# Altium project nRF24L01无线收发.PrjPCB
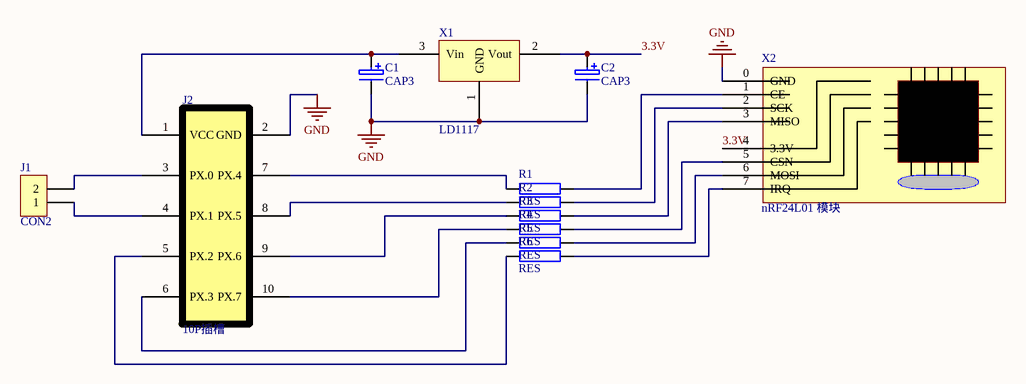
[diagram p0: nRF24L01 无线收发.SchDoc]
1 sheet, 12 parts. Net scope: global (net labels, ports and power ports of the same name join across sheets).
Board file: nRF24L01 无线收发.PcbDoc

## Sheet nRF24L01 无线收发.SchDoc
size A4

### Parts
C1  CAP3  [CAO1]
C2  CAP3  [CAO1]
J1  CON2  [sip-2]
J2  10P插槽  [10P插槽]
R1  RES  [AXIAL0.3]
R2  RES  [AXIAL0.3]
R3  RES  [AXIAL0.3]
R4  RES  [AXIAL0.3]
R5  RES  [AXIAL0.3]
R6  RES  [AXIAL0.3]
X1  LD1117  [SOT-223]
X2  nRF24L01 模块  [nRF24L01模块]

### Nets
GND: C1.2 C2.2 J2.2(GND) X1.1(GND) X2.0(GND)
3.3V: C2.1 X1.2(Vout) X2.4(3.3V)
NetC1_1: C1.1 J2.1(VCC) X1.3(Vin)
NetJ1_1: J1.1 J2.4(PX.1)
NetJ1_2: J1.2 J2.3(PX.0)
NetJ2_5: J2.5(PX.2) R6.1
NetJ2_6: J2.6(PX.3) R5.1
NetJ2_7: J2.7(PX.4) R1.1
NetJ2_8: J2.8(PX.5) R2.1
NetJ2_9: J2.9(PX.6) R3.1
NetJ2_10: J2.10(PX.7) R4.1
NetR1_2: R1.2 X2.1(CE)
NetR2_2: R2.2 X2.2(SCK)
NetR3_2: R3.2 X2.3(MISO)
NetR4_2: R4.2 X2.5(CSN)
NetR5_2: R5.2 X2.6(MOSI)
NetR6_2: R6.2 X2.7(IRQ)

### Library data of the parts
J1 = CON2: Connector